# Altium schematic sheet QTouch.SchDoc
size A4
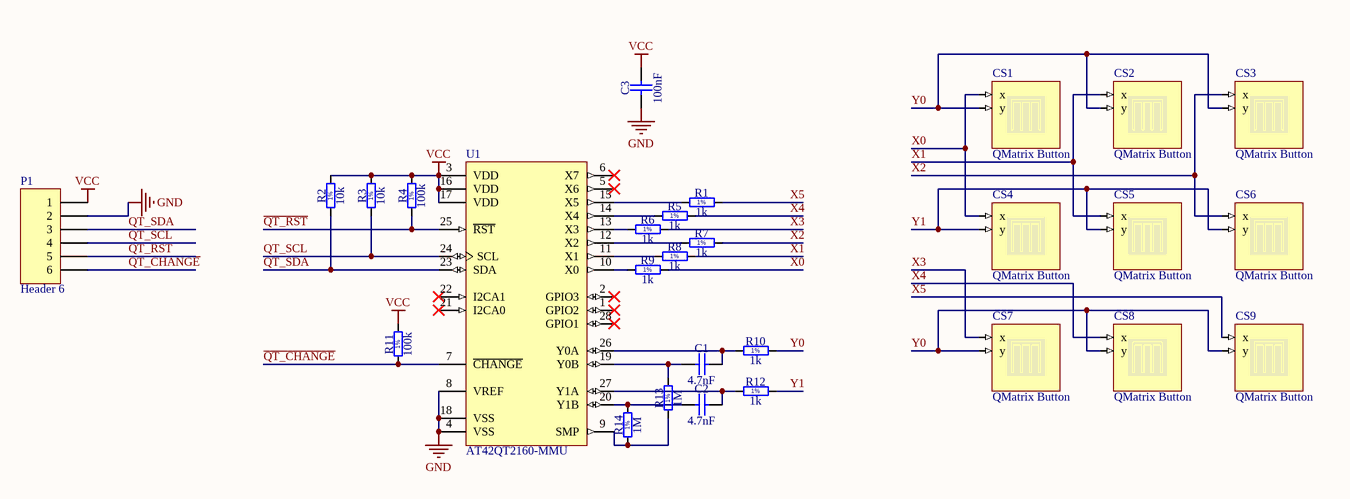
[diagram p0: QTouch.SchDoc]

## Parts
C1  4.7nF  [CAPC1005X55N]
C2  4.7nF  [CAPC1005X55N]
C3  100nF  [CAPC1005X55N]
CS1  QMatrix Button  (no BOM)
CS2  QMatrix Button  (no BOM)
CS3  QMatrix Button  (no BOM)
CS4  QMatrix Button  (no BOM)
CS5  QMatrix Button  (no BOM)
CS6  QMatrix Button  (no BOM)
CS7  QMatrix Button  (no BOM)
CS8  QMatrix Button  (no BOM)
CS9  QMatrix Button  (no BOM)
P1  Header 6  [header 2X3]
R1  1k  [RESC1005X40N]
R2  10k  [RESC1005X40N]
R3  10k  [RESC1005X40N]
R4  100k  [RESC1005X40N]
R5  1k  [RESC1005X40N]
R6  1k  [RESC1005X40N]
R7  1k  [RESC1005X40N]
R8  1k  [RESC1005X40N]
R9  1k  [RESC1005X40N]
R10  1k  [RESC1005X40N]
R11  100k  [RESC1005X40N]
R12  1k  [RESC1005X40N]
R13  1M  [RESC1005X40N]
R14  1M  [RESC1005X40N]
U1  AT42QT2160-MMU  [28M1_N]

## Nets
GND: C3.1 P1.2 U1.4(VSS) U1.8(VREF) U1.18(VSS)
VCC: C3.2 P1.1 R2.2 R3.2 R4.2 R11.2 U1.3(VDD) U1.16(VDD) U1.17(VDD)
~{QT_CHANGE}: P1.6 R11.1 U1.7(~{CHANGE})
~{QT_RST}: P1.5 R4.1 U1.25(~{RST})
QT_SCL: P1.4 R3.1 U1.24(SCL)
QT_SDA: P1.3 R2.1 U1.23(SDA)
X0: CS1.x CS4.x R9.2
X1: CS2.x CS5.x R8.2
X2: CS3.x CS6.x R7.2
X3: CS7.x R6.2
X4: CS8.x R5.2
X5: CS9.x R1.2
Y0: CS1.y CS2.y CS3.y CS7.y CS8.y CS9.y R10.2
Y1: CS4.y CS5.y CS6.y R12.2
NetC1_1: C1.1 R13.2 U1.19(Y0B)
NetC1_2: C1.2 R10.1 U1.26(Y0A)
NetC2_1: C2.1 R14.2 U1.20(Y1B)
NetC2_2: C2.2 R12.1 U1.27(Y1A)
NetR1_1: R1.1 U1.15(X5)
NetR5_1: R5.1 U1.14(X4)
NetR6_1: R6.1 U1.13(X3)
NetR7_1: R7.1 U1.12(X2)
NetR8_1: R8.1 U1.11(X1)
NetR9_1: R9.1 U1.10(X0)
NetR13_1: R13.1 R14.1 U1.9(SMP)

Not connected (* = marked no-connect by the designer): U1 1(GPIO2)* 2(GPIO3)* 5(X6)* 6(X7)* 21(I2CA0)* 22(I2CA1)* 28(GPIO1)*

## Notes on the sheet
- (in symbol R0402_1K_1%_0.0625W_100PPM) 1%
- (in symbol R0402_1M_1%_0.0625W_100PPM) 1%
- (in symbol R0402_10K_1%_0.0625W_100PPM) 1%
- (in symbol R0402_100K_1%_0.0625W_100PPM) 1%

## Library data of the parts
C1 C2 = CC0402_4.7NF_16V_10%_X7R: Non-polarised capacitor; Part Description: SMD Multilayer Chip Ceramic Capacitor; Manufacturer: GENERIC; Manufacturer1 Part Number: 223878715632; Voltage: 16V; TC: X7R; Tolerance: ±10%; Table: Capacitors SMD; Part Number: CC0402_4.7NF_16V_10%_X7R; Component Kind: Standard; Component Type: Standard; Pin Count: 2; Value: 4.7nF; Status: Not Recommended; Manufacturer Part Number: CC0402_4.7NF_16V_10%_X7R; Case: 0402; Mounted: Yes; Socket: No; SMD: Yes; Manufacturer1 Example: PHYCOMP; Manufacturer1 ComponentHeight: 0.55mm; HelpURL: \\cern.ch\dfs\Applications\Altium\Datasheets\CC0402_X7R_PHYCOMP.pdf; Author: CERN DEM JLC; CreateDate: 2007-12-03; LatestRevisionDate: 2007-12-03
C3 = CC0402_100NF_16V_10%_X7R: Non-polarised capacitor; Part Description: SMD Multilayer Chip Ceramic Capacitor; Manufacturer: GENERIC; Manufacturer1 Part Number: 223878715649; Voltage: 16V; TC: X7R; Tolerance: ±10%; Table: Capacitors SMD; Part Number: CC0402_100NF_16V_10%_X7R; Component Kind: Standard; Component Type: Standard; Pin Count: 2; Value: 100nF; Status: Not Recommended; Manufacturer Part Number: CC0402_100NF_16V_10%_X7R; Case: 0402; Mounted: Yes; Socket: No; SMD: Yes; Manufacturer1 Example: PHYCOMP; Manufacturer1 ComponentHeight: 0.55mm; HelpURL: \\cern.ch\dfs\Applications\Altium\Datasheets\CC0402_X7R_PHYCOMP.pdf; Author: CERN DEM JLC; CreateDate: 2007-12-03; LatestRevisionDate: 2007-12-03
CS1-CS9 = QMatrixButton: ConfiguratorName: ATMEL_TOUCH; ConfigurationParameters: {}__sensorid[2]{}width[10]{}height[10]{}t[1]{}ywidth[0.5]{}
P1 = Header 6: Header, 6-Pin; LatestRevisionDate: 17-Jul-2002; LatestRevisionNote: Re-released for DXP Platform.; Publisher: Altium Limited
R1 R5-R10 R12 = R0402_1K_1%_0.0625W_100PPM: Resistor - 1%; Part Description: General Purpose Thick Film Chip Resistor; Manufacturer: GENERIC; Manufacturer1 Part Number: 232270671002; TC: ±100ppm/°C; Table: Resistors SMD; Part Number: R0402_1K_1%_0.0625W_100PPM; Component Kind: Standard; Component Type: Standard; Pin Count: 2; Value: 1k; Status: Not recommended; Power: 0.0625W; Tolerance: ±1%; Manufacturer Part Number: R0402_1K_1%_0.0625W_100PPM; Case: 0402; Mounted: Yes; Socket: No; SMD: Yes; Manufacturer1 Example: PHYCOMP; Manufacturer1 ComponentHeight: 0.4mm; HelpURL: \\cern.ch\dfs\Applications\Altium\Datasheets\R0402_Phycomp_RC0402.pdf; Author: CERN DEM JLC; CreateDate: 2007-12-03; LatestRevisionDate: 2008-03-13
R2 R3 = R0402_10K_1%_0.0625W_100PPM: Resistor - 1%; Part Description: General Purpose Thick Film Chip Resistor; Manufacturer: GENERIC; Manufacturer1 Part Number: 232270671003; TC: ±100ppm/°C; Table: Resistors SMD; Part Number: R0402_10K_1%_0.0625W_100PPM; Component Kind: Standard; Component Type: Standard; Pin Count: 2; Value: 10k; Status: Not recommended; Power: 0.0625W; Tolerance: ±1%; Manufacturer Part Number: R0402_10K_1%_0.0625W_100PPM; Case: 0402; Mounted: Yes; Socket: No; SMD: Yes; Manufacturer1 Example: PHYCOMP; Manufacturer1 ComponentHeight: 0.4mm; HelpURL: \\cern.ch\dfs\Applications\Altium\Datasheets\R0402_Phycomp_RC0402.pdf; Author: CERN DEM JLC; CreateDate: 2007-12-03; LatestRevisionDate: 2008-03-13
R4 R11 = R0402_100K_1%_0.0625W_100PPM: Resistor - 1%; Part Description: General Purpose Thick Film Chip Resistor; Manufacturer: GENERIC; Manufacturer1 Part Number: 232270671004; TC: ±100ppm/°C; Table: Resistors SMD; Part Number: R0402_100K_1%_0.0625W_100PPM; Component Kind: Standard; Component Type: Standard; Pin Count: 2; Value: 100k; Status: Not recommended; Power: 0.0625W; Tolerance: ±1%; Manufacturer Part Number: R0402_100K_1%_0.0625W_100PPM; Case: 0402; Mounted: Yes; Socket: No; SMD: Yes; Manufacturer1 Example: PHYCOMP; Manufacturer1 ComponentHeight: 0.4mm; HelpURL: \\cern.ch\dfs\Applications\Altium\Datasheets\R0402_Phycomp_RC0402.pdf; Author: CERN DEM JLC; CreateDate: 2007-12-03; LatestRevisionDate: 2008-03-13
R13 R14 = R0402_1M_1%_0.0625W_100PPM: Resistor - 1%; Part Description: General Purpose Thick Film Chip Resistor; Manufacturer: GENERIC; Manufacturer1 Part Number: 232270671005; TC: ±100ppm/°C; Table: Resistors SMD; Part Number: R0402_1M_1%_0.0625W_100PPM; Component Kind: Standard; Component Type: Standard; Pin Count: 2; Value: 1M; Status: Not recommended; Power: 0.0625W; Tolerance: ±1%; Manufacturer Part Number: R0402_1M_1%_0.0625W_100PPM; Case: 0402; Mounted: Yes; Socket: No; SMD: Yes; Manufacturer1 Example: PHYCOMP; Manufacturer1 ComponentHeight: 0.4mm; HelpURL: \\cern.ch\dfs\Applications\Altium\Datasheets\R0402_Phycomp_RC0402.pdf; Author: CERN DEM JLC; CreateDate: 2007-12-03; LatestRevisionDate: 2008-03-13
U1 = AT42QT2160-MMU: QSlide 16-key QMatrix Sensor IC, 28-Pin VQFN; Published: 1-Apr-2010; DatasheetVersion: revA, Jul-2008; PackageVersion: revB, Nov-2008; PackageReference: 28M1; Publisher: Altium Limited; PackageDescription: 28-pad, 4x4x1.0mm Body, Pitch 0.45mm, 2.4x2.4mm Exposed Pad, Plastic Very Thin QFN Package (VQFN); Supplier 1: Digi-Key; Supplier Part Number 1: 427-1140-2-ND; Supplier 2: Digi-Key; Supplier Part Number 2: 427-1140-1-ND; Supplier 3: Digi-Key; Supplier Part Number 3: 427-1140-6-ND; Supplier 4: Farnell; Supplier Part Number 4: 1748491; Supplier 5: Mouser; Supplier Part Number 5: 556-AT42QT2160-MMU; ComponentLink1Description: Manufacturer Link; ComponentLink1URL: http://www.atmel.com/products/overview_touch.asp?; ComponentLink2Description: AT42QT2160 Summary; ComponentLink2URL: http://www.atmel.com/dyn/resources/prod_documents/AT42QT2160_DS.pdf; ComponentLink3Description: Atmel.com Home; ComponentLink3URL: http://www.atmel.com